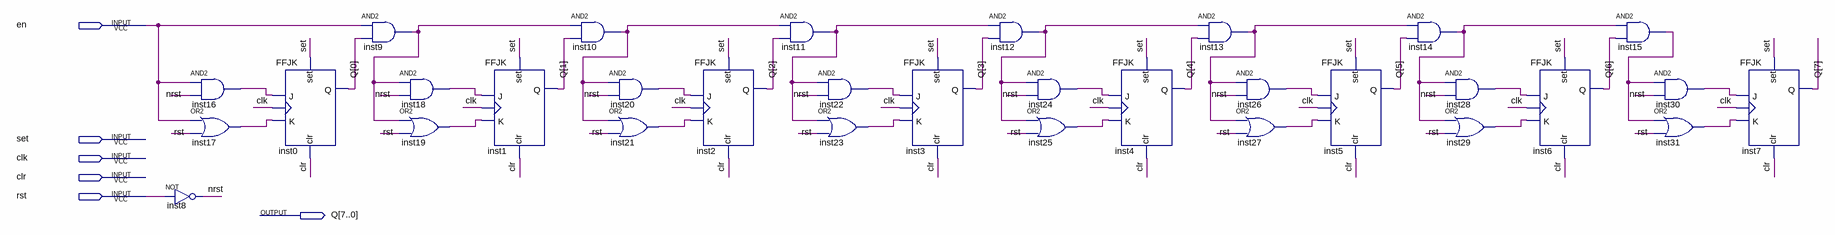
[diagram p0: schematic sheet]
// Quartus schematic Counter8.bdf as structural Verilog: 32 symbols, 6 pins
module Counter8 (
  input  en,
  input  set,
  input  clk,
  input  clr,
  input  rst,
  output [7:0] Q
);

  wire inst9_out, inst10_out, inst11_out, inst12_out, inst13_out, inst14_out, inst15_out, inst16_out,
       inst17_out, inst18_out, inst19_out, inst20_out, inst21_out, inst22_out, inst23_out, inst24_out,
       inst25_out, inst26_out, inst27_out, inst28_out, inst29_out, inst30_out, inst31_out, nrst;

  not inst8 (nrst, rst);
  and inst16 (inst16_out, en, nrst);
  or inst17 (inst17_out, en, rst);
  FFJK inst0 (.set(set), .J(inst16_out), .K(inst17_out), .clr(clr), .clk(clk), .Q(Q[0]));
  and inst9 (inst9_out, en, Q[0]);
  and inst18 (inst18_out, inst9_out, nrst);
  or inst19 (inst19_out, inst9_out, rst);
  FFJK inst1 (.set(set), .J(inst18_out), .K(inst19_out), .clr(clr), .clk(clk), .Q(Q[1]));
  and inst10 (inst10_out, inst9_out, Q[1]);
  and inst20 (inst20_out, inst10_out, nrst);
  or inst21 (inst21_out, inst10_out, rst);
  FFJK inst2 (.set(set), .J(inst20_out), .K(inst21_out), .clr(clr), .clk(clk), .Q(Q[2]));
  and inst11 (inst11_out, inst10_out, Q[2]);
  and inst22 (inst22_out, inst11_out, nrst);
  or inst23 (inst23_out, inst11_out, rst);
  FFJK inst3 (.set(set), .J(inst22_out), .K(inst23_out), .clr(clr), .clk(clk), .Q(Q[3]));
  and inst12 (inst12_out, inst11_out, Q[3]);
  and inst24 (inst24_out, inst12_out, nrst);
  or inst25 (inst25_out, inst12_out, rst);
  FFJK inst4 (.set(set), .J(inst24_out), .K(inst25_out), .clr(clr), .clk(clk), .Q(Q[4]));
  and inst13 (inst13_out, inst12_out, Q[4]);
  and inst26 (inst26_out, inst13_out, nrst);
  or inst27 (inst27_out, inst13_out, rst);
  FFJK inst5 (.set(set), .J(inst26_out), .K(inst27_out), .clr(clr), .clk(clk), .Q(Q[5]));
  and inst14 (inst14_out, inst13_out, Q[5]);
  and inst28 (inst28_out, inst14_out, nrst);
  or inst29 (inst29_out, inst14_out, rst);
  FFJK inst6 (.set(set), .J(inst28_out), .K(inst29_out), .clr(clr), .clk(clk), .Q(Q[6]));
  and inst15 (inst15_out, inst14_out, Q[6]);
  and inst30 (inst30_out, inst15_out, nrst);
  or inst31 (inst31_out, inst15_out, rst);
  FFJK inst7 (.set(set), .J(inst30_out), .K(inst31_out), .clr(clr), .clk(clk), .Q(Q[7]));
endmodule
